# EAGLE design sensor_current (EAGLE 9.1.3)
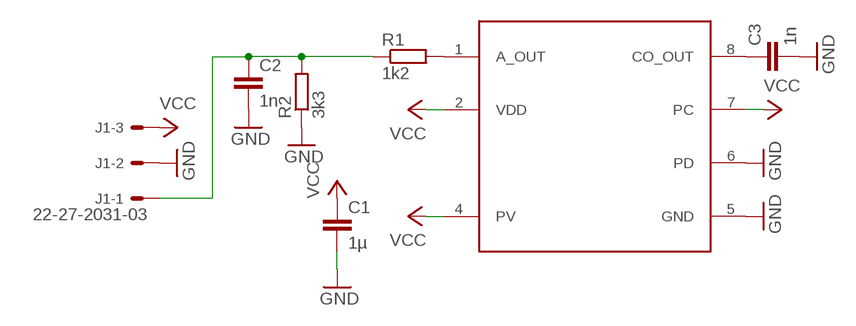
[diagram p0: schematic, sheet 1]

## Parts
C1  1µ  C-EU025-024X044  [C025-024X044]
C2  1n  C-EU025-024X044  [C025-024X044]
C3  1n  C-EU025-024X044  [C025-024X044]
IC1  MLX91205  [SO-08]
J1  22-27-2031-03  [6410-03]
R1  1k2  R-EU_0204/2V  [0204V]
R2  3k3  R-EU_0204/2V  [0204V]

## Nets
GND: C1.2 C2.2 C3.2 IC1.5(GND) IC1.6(PD) J1.2 R2.1
N$1: IC1.1(A_OUT) R1.2
N$2: C3.1 IC1.8(CO_OUT)
N$3: C2.1 J1.1 R1.1 R2.2
VCC: C1.1 IC1.2(VDD) IC1.4(PV) IC1.7(PC) J1.3

## Library data of the parts
C1-C3 = rcl:C-EU: CAPACITOR, European symbol
IC1 = melexis:MLX91205
J1 = con-molex:22-?-03: CONNECTOR wire to board 2.54 mm (.1 inch) pitch header; OC_FARNELL: unknown; OC_NEWARK: unknown
R1 R2 = rcl:R-EU_: RESISTOR, European symbol

## Board
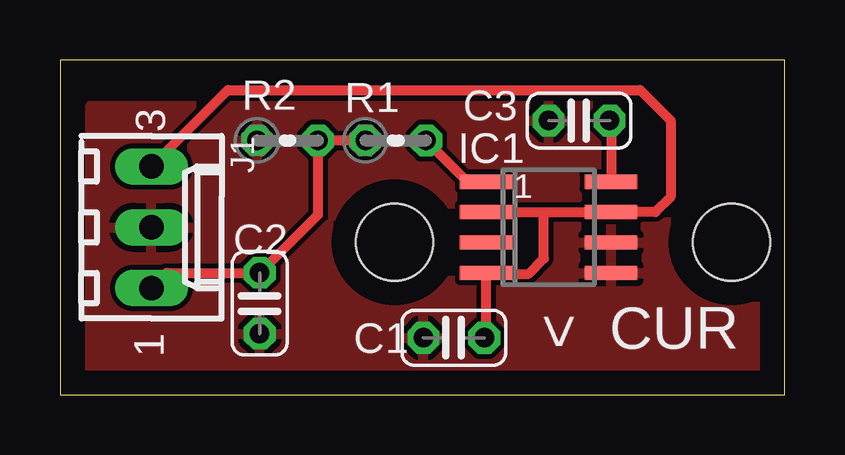
[diagram p1: board, top side]

Size 30.19 x 13.96 mm. Coordinates in mm from the lower left corner, seen from the top.
Outline: 0,0 30.19,0 30.19,13.96 0,13.96 0,0
Copper layers (1*16): Top 0.035mm / dielectric 1.5mm / Bottom 0.035mm
Design rules "default": minimum track width 10mil, minimum drill 24mil, track to track 8mil, track to pad 8mil, pad to pad 8mil, via to via 8mil, smd to smd 8mil, copper to edge 40mil, drill to drill 8mil, minimum pad ring 10mil, minimum via ring 8mil, stop-mask expansion 4mil, vias tented up to drill 0mil, thermal gap 10mil
Holes 3.2 mm at 27.98,6.36 13.94,6.36

### Footprints (pad centres in the part's own frame; a part is rotated, then mirrored left to right if it is on the bottom)
C025-024X044 = drill 0.813 octagon: 1 -1.27,0; 2 1.27,0
SO-08 = smd 0.6 x 2.2: 1 -1.905,-2.6; 2 -0.635,-2.6; 3 0.635,-2.6; 4 1.905,-2.6; 5 1.905,2.6; 6 0.635,2.6; 7 -0.635,2.6; 8 -1.905,2.6
6410-03 = drill 1.016 long: 1 2.54,0; 2 0,0; 3 -2.54,0
0204V = drill 0.813 octagon: 1 -1.27,0; 2 1.27,0

### Placement (x,y rotation side)
C1  16.41,2.37 180 top
C2  8.32,3.81 270 top
C3  21.63,11.43 180 top
IC1  20.36,6.98 270 top
J1  3.81,6.98 270 top
R1  13.99,10.6 0 top
R2  9.48,10.6 0 top

### Tracks (layer width: path | path; a pad name or v marks a point on that pad's centre or on a via)
GND
  pour Top: 1.27,12.06 29.25,12.06 29.25,0.01 1.27,0.01
N$1
  Top 0.406: R1.2 16.98,8.88 IC1.1
N$2
  Top 0.406: C3.1 22.96,11.68 IC1.8
N$3
  Top 0.406: R1.1 R2.2 10.75,7.51 C2.1 4.45,5.08 J1.1
VCC
  Top 0.406: IC1.2 20.16,7.62 | 20.16,7.62 IC1.7 24.8,7.62 25.44,8.25 25.44,11.43 24.17,12.7 6.99,12.7 J1.3 | C1.1 17.76,2.51 IC1.4 17.8,5.04 19.53,5.04 20.16,5.67 20.16,7.62

### Text on the board
tPlace: 1
tNames: < | CUR